# EAGLE design PCB__ARDUINO_SKYWRITTER_3D (EAGLE 9.6.2)
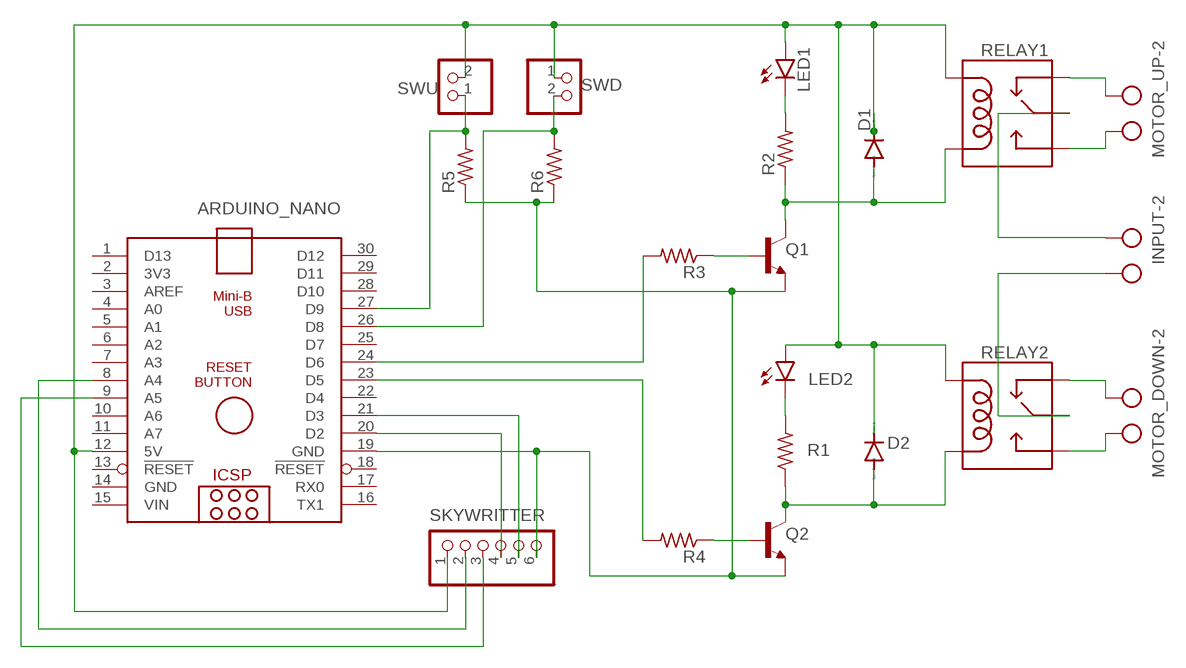
[diagram p0: schematic, sheet 1]

## Parts
ARDUINO_NANO  ARDUINO_NANO  [ARDUINO_NANO]
D1  1N4446  [DO35-10]
D2  1N4446  [DO35-10]
INPUT  AK500/2  [AK500/2]
LED1  TLLR4400  [LED3MM]
LED2  TLLR4400  [LED3MM]
MOTOR_DOWN  AK500/2  [AK500/2]
MOTOR_UP  AK500/2  [AK500/2]
Q1  2N3904  [TO92]
Q2  2N3904  [TO92]
R1  R-US_0207/10  [0207/10]
R2  R-US_0207/10  [0207/10]
R3  R-US_0207/10  [0207/10]
R4  R-US_0207/10  [0207/10]
R5  R-US_0207/10  [0207/10]
R6  R-US_0207/10  [0207/10]
RELAY1  RELAYPTH  [SRD-05VDC-SL-C]
RELAY2  RELAYPTH  [SRD-05VDC-SL-C]
SKYWRITTER  PINHD-1X6  [1X06]
SWD  PINHD-1X2  [1X02]
SWU  PINHD-1X2  [1X02]

## Nets
N$1: Q1.1(C) R2.1
N$2: INPUT.1 RELAY2.SWCOMMON
N$3: MOTOR_DOWN.1 RELAY2.SWOPEN
N$4: MOTOR_DOWN.2 RELAY2.SWCLOSED(SWCLOSE)
N$5: ARDUINO_NANO.20(D2) SKYWRITTER.4
N$6: LED2.K(C) R1.2
N$7: D2.A Q2.1(C) R1.1 RELAY2.COIL0
N$8: Q2.2(B) R4.1
N$9: Q1.2(B) R3.1
N$10: D1.A RELAY1.COIL0
N$11: LED1.K(C) R2.2
N$12: INPUT.2 RELAY1.SWCOMMON
N$13: MOTOR_UP.2 RELAY1.SWCLOSED(SWCLOSE)
N$14: MOTOR_UP.1 RELAY1.SWOPEN
N$15: ARDUINO_NANO.27(D9) R5.2 SWU.1
N$16: ARDUINO_NANO.26(D8) R6.2 SWD.2
N$17: ARDUINO_NANO.24(D6) R3.2
N$19: ARDUINO_NANO.23(D5) R4.2
N$20: ARDUINO_NANO.19(GND) Q1.3(E) Q2.3(E) R5.1 R6.1 SKYWRITTER.6
N$21: ARDUINO_NANO.21(D3) SKYWRITTER.5
N$23: ARDUINO_NANO.12(5V) D1.C D2.C LED1.A LED2.A RELAY1.COIL1 RELAY2.COIL1 SKYWRITTER.1 SWD.1 SWU.2
N$24: ARDUINO_NANO.8(A4) SKYWRITTER.2
N$25: ARDUINO_NANO.9(A5) SKYWRITTER.3
Unconnected: ARDUINO_NANO.1(D13) ARDUINO_NANO.2(3V3) ARDUINO_NANO.3(AREF) ARDUINO_NANO.4(A0) ARDUINO_NANO.5(A1) ARDUINO_NANO.6(A2) ARDUINO_NANO.7(A3) ARDUINO_NANO.10(A6) ARDUINO_NANO.11(A7) ARDUINO_NANO.13(!RESET) ARDUINO_NANO.16(TX1) ARDUINO_NANO.17(RX0) ARDUINO_NANO.18(!RESET) ARDUINO_NANO.22(D4) ARDUINO_NANO.25(D7) ARDUINO_NANO.28(D10) ARDUINO_NANO.29(D11) ARDUINO_NANO.30(D12)

## Power pins joined to a net without a drawn wire
GND: ARDUINO_NANO.14(GND)
VIN: ARDUINO_NANO.15(VIN)

## Library data of the parts
ARDUINO_NANO = A_ArduinoNanoV30:ARDUINO_NANO: Arduino Nano V3.0 Overview: The Arduino Nano is a small, complete, and breadboard-friendly board based on the ATmega328 (Arduino Nano 3.x) or ATmega168 (Arduino Nano 2.x). It has more or less the same functionality of the Arduino Duemilanove, but in a different package. It lacks only a DC power jack, and works with a Mini-B USB cable instead of a standard one. The Nano was designed and is being produced by Gravitech. Specifications: Microcontroller Atmel ATmega168 or ATmega328 Operating Voltage (logic level) 5 V Input Voltage (recommended) 7-12 V Input Voltage (limits) 6-20 V Digital I/O Pins 14 (of which 6 provide PWM output) Analog Input Pins 8 DC Current per I/O Pin 40 mA Flash Memory 16 KB (ATmega168) or 32 KB (ATmega328) of which 2 KB used by bootloader SRAM 1 KB (ATmega168) or 2 KB (ATmega328) EEPROM 512 bytes (ATmega168) or 1 KB (ATmega328) Clock Speed 16 MHz Dimensions 0.73" x 1.70" Length 45 mm Width 18 mm Weigth 5 g Power: The Arduino Nano can be powered via the Mini-B USB connection, 6-20V unregulated external power supply (pin 30), or 5V regulated external power supply (pin 27). The power source is automatically selected to the highest voltage source. Memory: The ATmega168 has 16 KB of flash memory for storing code (of which 2 KB is used for the bootloader); the ATmega328 has 32 KB, (also with 2 KB used for the bootloader). The ATmega168 has 1 KB of SRAM and 512 bytes of EEPROM (which can be read and written with the EEPROM library); the ATmega328 has 2 KB of SRAM and 1 KB of EEPROM. Input and Output: Each of the 14 digital pins on the Nano can be used as an input or output, using pinMode(), digitalWrite(), and digitalRead() functions. They operate at 5 volts. Each pin can provide or receive a maximum of 40 mA and has an internal pull-up resistor (disconnected by default) of 20-50 kOhms. In addition, some pins have specialized functions. Visit Arduino - ArduinoBoardNano <https://www.arduino.cc/en/Main/ArduinoBoardNano>
D1 D2 = diode:1N4446: DIODE high speed (Philips)
INPUT MOTOR_DOWN MOTOR_UP = con-ptr500:AK500/2: CONNECTOR; OC_FARNELL: unknown; OC_NEWARK: unknown
LED1 LED2 = led:TLLR4400: Low Current (2mA) LED 3 mm Tinted Diffused Package color RED Source: Data sheet <http://www.farnell.com/datasheets/391100.pdf>; MF: VISHAY SEMICONDUCTOR; OC_FARNELL: 1612437
Q1 Q2 = transistor-npn:2N3904: NPN Transistor
R1-R6 = rcl:R-US_: RESISTOR, American symbol; SPICEPREFIX: R
RELAY1 RELAY2 = SRD-05VDC-SL-C:RELAY: SPDT relay (COM-00101)
SKYWRITTER = pinhead:PINHD-1X6: PIN HEADER
SWD SWU = pinhead:PINHD-1X2: PIN HEADER

## Board
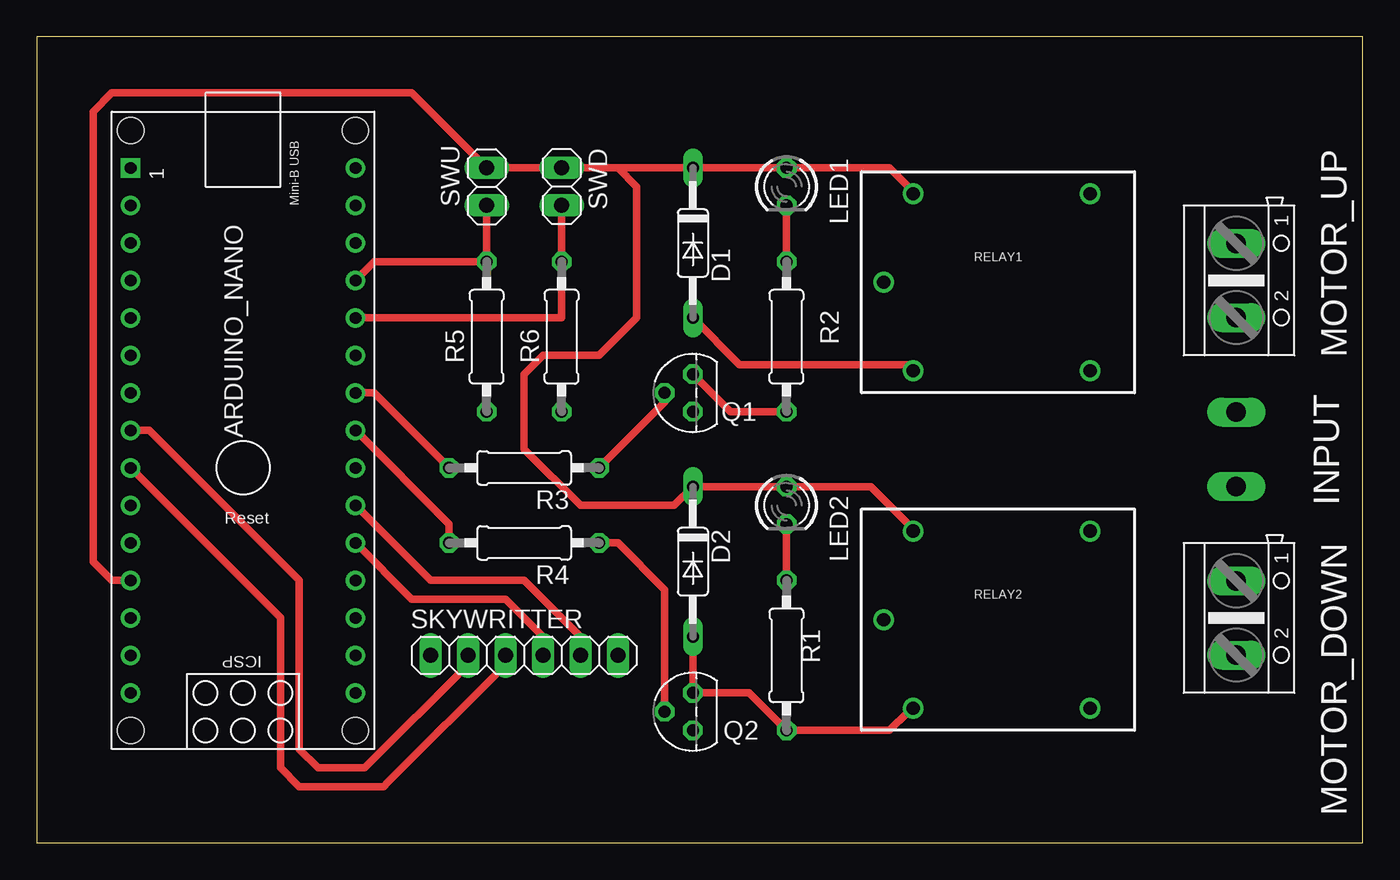
[diagram p1: board, top side]
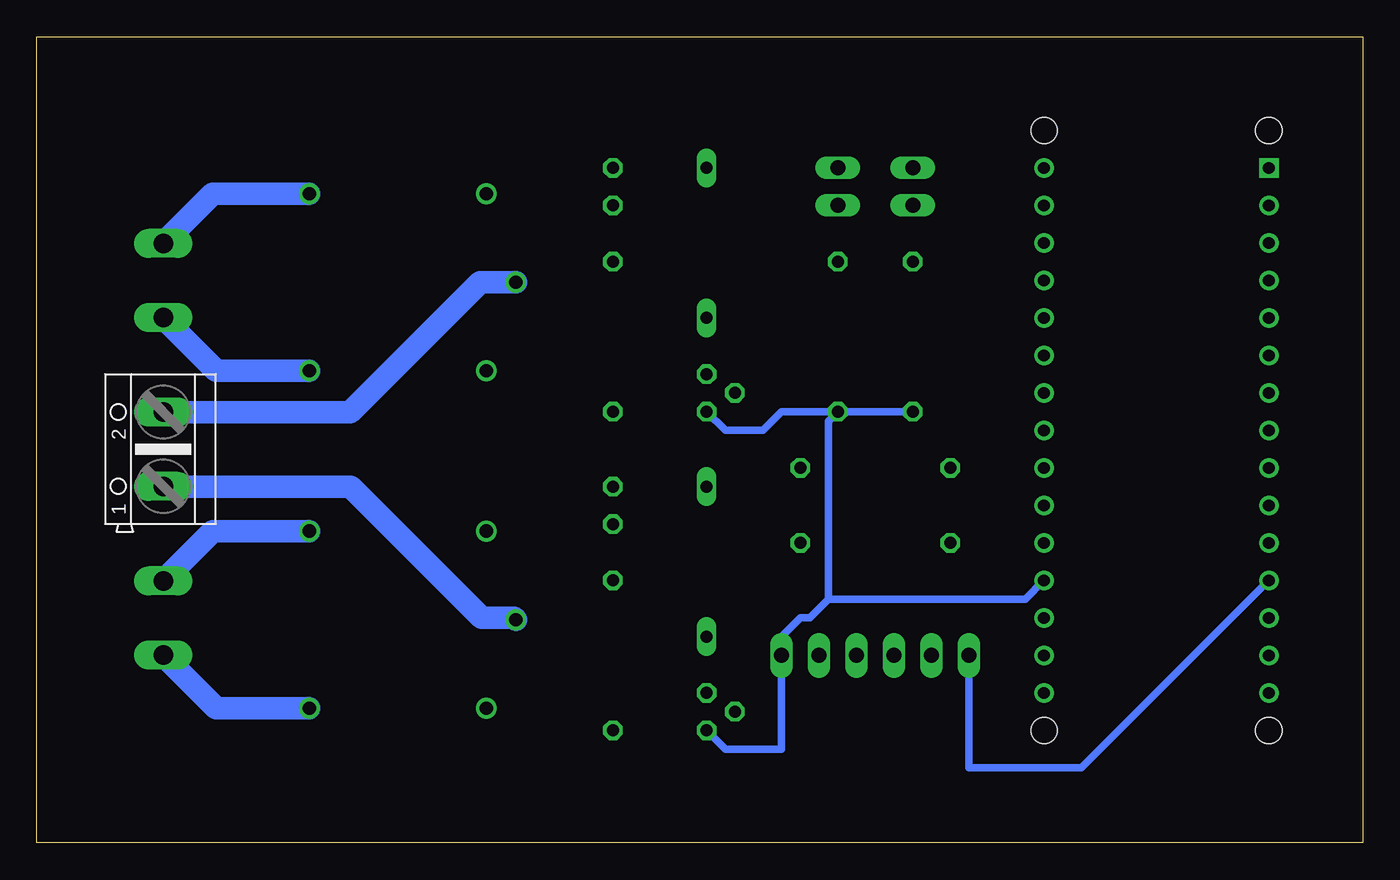
[diagram p2: board, bottom side, seen from below]

Size 89.84 x 54.6 mm. Coordinates in mm from the lower left corner, seen from the top.
Outline: 0,0 89.84,0 89.84,54.6 0,54.6 0,0
Copper layers (1*16): Top 0.06mm / dielectric 1.5mm / Bottom 0.06mm
Design rules "Pedro": minimum track width 20mil, minimum drill 0.35mm, track to track 20mil, track to pad 20mil, pad to pad 20mil, via to via 20mil, smd to smd 20mil, copper to edge 35mil, drill to drill 6mil, minimum pad ring 10mil, minimum via ring 8mil, stop-mask expansion 4mil, vias tented up to drill 0mil, thermal gap 10mil

### Footprints (pad centres in the part's own frame; a part is rotated, then mirrored left to right if it is on the bottom)
ARDUINO_NANO = drill 0.8 square: 1 -20.32,-7.62 | drill 0.8: 2 -17.78,-7.62; 3 -15.24,-7.62; 4 -12.7,-7.62; 5 -10.16,-7.62; 6 -7.62,-7.62; 7 -5.08,-7.62; 8 -2.54,-7.62; 9 0,-7.62; 10 2.54,-7.62; 11 5.08,-7.62; 12 7.62,-7.62; 13 10.16,-7.62; 14 12.7,-7.62; 15 15.24,-7.62; 16 15.24,7.62; 17 12.7,7.62; 18 10.16,7.62; 19 7.62,7.62; 20 5.08,7.62; 21 2.54,7.62; 22 0,7.62; 23 -2.54,7.62; 24 -5.08,7.62; 25 -7.62,7.62; 26 -10.16,7.62; 27 -12.7,7.62; 28 -15.24,7.62; 29 -17.78,7.62; 30 -20.32,7.62 | hole 1.778: -22.86,-7.62; -22.86,7.62; 17.78,7.62; 17.78,-7.62
DO35-10 = drill 0.813 long: A 5.08,0; C -5.08,0
AK500/2 = drill 1.321 long: 1 -2.515,0; 2 2.515,0
LED3MM = drill 0.813 octagon: A -1.27,0; K 1.27,0
TO92 = drill 0.813 octagon: 1 1.27,0; 2 0,1.905; 3 -1.27,0
0207/10 = drill 0.813 octagon: 1 -5.08,0; 2 5.08,0
SRD-05VDC-SL-C = drill 0.9: COIL0 -5.39,-6.12; COIL1 -5.39,5.88; SWCLOSED 6.61,-6.12; SWCOMMON -7.39,-0.12; SWOPEN 6.61,5.88
1X06 = drill 1.016 long: 1 -6.35,0; 2 -3.81,0; 3 -1.27,0; 4 1.27,0; 5 3.81,0; 6 6.35,0
1X02 = drill 1.016 long: 1 -1.27,0; 2 1.27,0

### Placement (x,y rotation side)
ARDUINO_NANO  13.97,25.4 270 top
D1  44.45,40.64 270 top
D2  44.45,19.05 270 top
INPUT  81.28,26.67 90 bottom
LED1  50.8,44.45 270 top
LED2  50.8,22.86 270 top
MOTOR_DOWN  81.28,15.24 270 top
MOTOR_UP  81.28,38.1 270 top
Q1  44.45,30.48 90 top
Q2  44.45,8.89 90 top
R1  50.8,12.7 90 top
R2  50.8,34.29 90 top
R3  33.02,25.4 180 top
R4  33.02,20.32 180 top
R5  30.48,34.29 90 top
R6  35.56,34.29 90 top
RELAY1  64.77,38.1 0 top
RELAY2  64.77,15.24 0 top
SKYWRITTER  33.02,12.7 0 top
SWD  35.56,44.45 270 top
SWU  30.48,44.45 90 top

### Tracks (layer width: path | path; a pad name or v marks a point on that pad's centre or on a via)
N$1
  Top 0.508: Q1.1 46.99,29.21 R2.1
N$2
  Bottom 1.524: INPUT.1 81.26,24.13 68.58,24.13 59.69,15.24 57.5,15.24 RELAY2.SWCOMMON
N$3
  Bottom 1.524: MOTOR_DOWN.1 77.92,21.12 RELAY2.SWOPEN
N$4
  Bottom 1.524: RELAY2.SWCLOSED 77.68,9.12 MOTOR_DOWN.2
N$5
  Top 0.508: ARDUINO_NANO.20 25.4,16.51 31.75,16.51 34.29,13.97 SKYWRITTER.4
N$6
  Top 0.508: LED2.K R1.2
N$7
  Top 0.508: D2.A Q2.1 48.26,10.16 R1.1 57.79,7.62 59.05,8.89 RELAY2.COIL0
N$8
  Top 0.508: Q2.2 42.55,17.14 39.37,20.32 R4.1
N$9
  Top 0.508: Q1.2 42.55,29.85 R3.1
N$10
  Top 0.508: D1.A 47.62,32.39 59.05,32.39 RELAY1.COIL0
N$11
  Top 0.508: LED1.K R2.2
N$12
  Bottom 1.524: RELAY1.SWCOMMON 59.81,37.98 68.61,29.18 INPUT.2
N$13
  Bottom 1.524: RELAY1.SWCLOSED 77.68,31.98 MOTOR_UP.2
N$14
  Bottom 1.524: RELAY1.SWOPEN 77.92,43.98 MOTOR_UP.1
N$15
  Top 0.508: ARDUINO_NANO.27 22.86,39.37 R5.2 SWU.1
N$16
  Top 0.508: ARDUINO_NANO.26 35.56,35.56 R6.2 SWD.2
N$17
  Top 0.508: R3.2 22.86,30.48 ARDUINO_NANO.24
N$19
  Top 0.508: ARDUINO_NANO.23 27.94,21.59 R4.2
N$20
  Bottom 0.508: R6.1 R5.1 | ARDUINO_NANO.19 22.86,16.51 36.2,16.51 | Q2.3 43.18,6.35 39.37,6.35 SKYWRITTER.6 39.37,13.97 38.1,15.24 37.46,15.24 36.2,16.51 | 36.2,16.51 36.2,28.57 R6.1 | R6.1 39.37,29.21 40.64,27.94 43.18,27.94 Q1.3
N$21
  Top 0.508: ARDUINO_NANO.21 26.67,17.78 33.02,17.78 36.83,13.97 SKYWRITTER.5
N$23
  Top 0.508: RELAY2.COIL1 59.05,21.59 56.52,24.13 LED2.A D2.C 43.18,22.86 36.83,22.86 33.02,26.67 33.02,31.75 34.29,33.02 38.1,33.02 40.64,35.56 40.64,44.45 39.37,45.72 | RELAY1.COIL1 59.05,44.45 57.79,45.72 LED1.A D1.C 39.37,45.72 | 39.37,45.72 SWD.1 SWU.2 25.4,50.8 5.08,50.8 3.81,49.53 3.81,19.05 5.08,17.78 ARDUINO_NANO.12
  Bottom 0.508: ARDUINO_NANO.12 19.05,5.08 26.67,5.08 SKYWRITTER.1
N$24
  Top 0.508: SKYWRITTER.2 29.21,12.07 22.23,5.08 19.05,5.08 17.78,6.35 17.78,17.78 7.62,27.94 ARDUINO_NANO.8
N$25
  Top 0.508: ARDUINO_NANO.9 16.51,15.24 16.51,5.08 17.78,3.81 23.49,3.81 23.81,4.13 31.75,12.07 SKYWRITTER.3